# Altium schematic sheet MCU.SchDoc
size A4
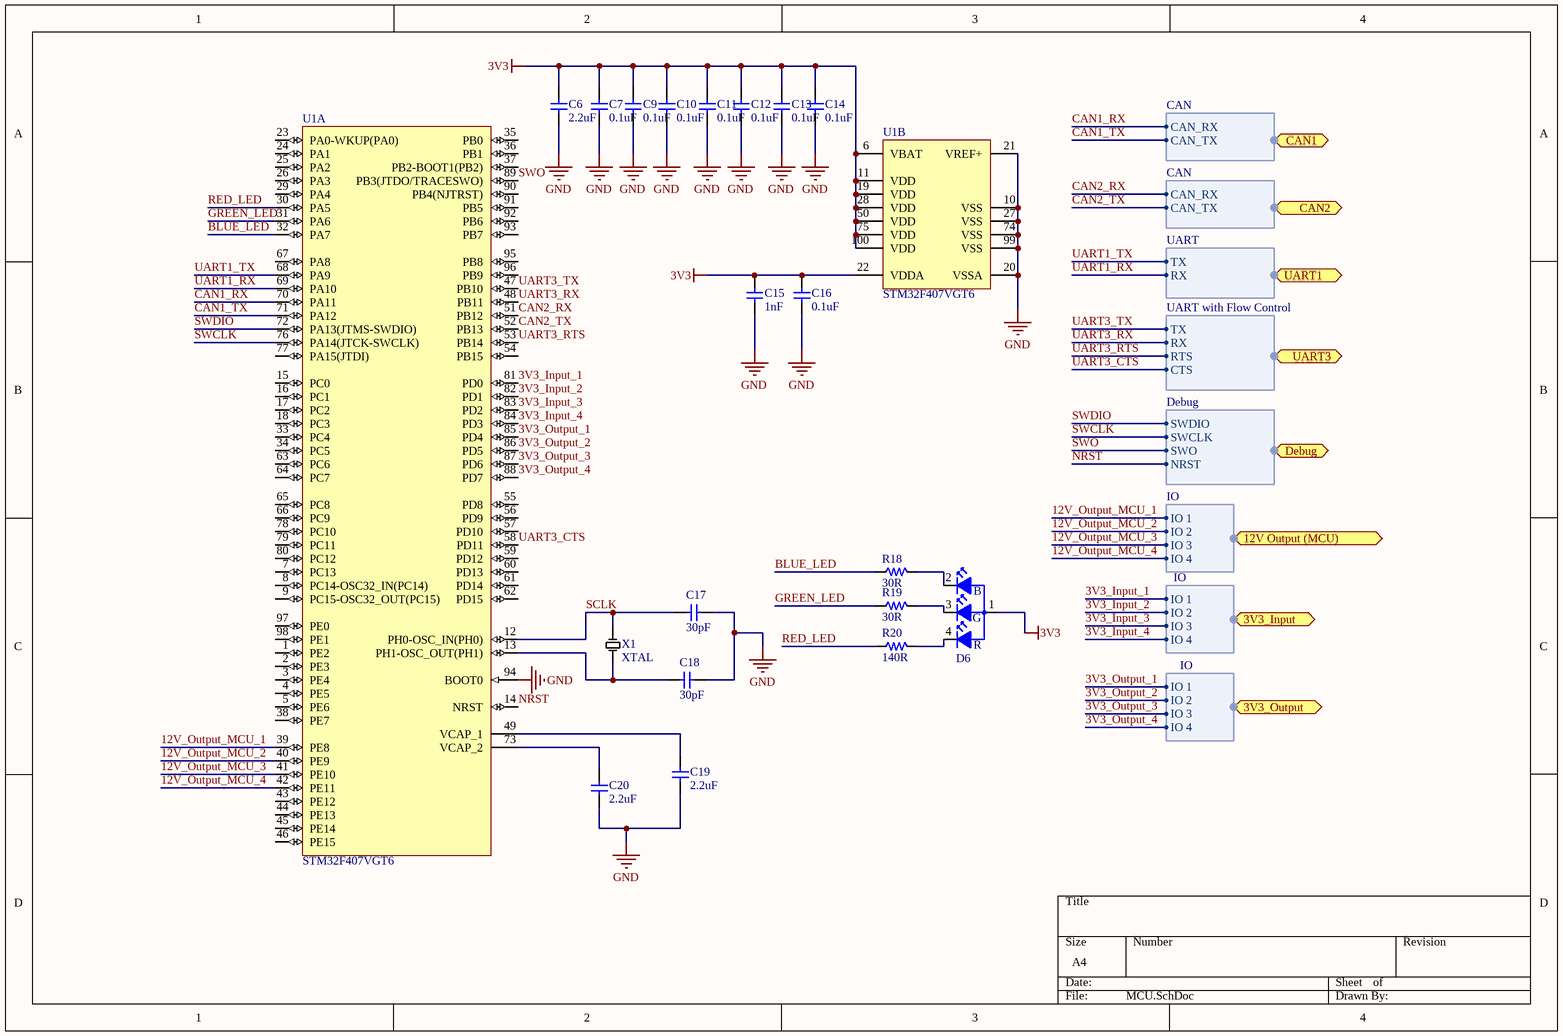
[diagram p0: MCU.SchDoc]

## Parts
C6  value 2.2uF  [PCB_GENERIC_SMD_0603]  (hidden comment: C060-002U2-00)
C7  value 0.1uF  [PCB_GENERIC_SMD_0603]  (hidden comment: C060-000U1-00)
C9  value 0.1uF  [PCB_GENERIC_SMD_0603]  (hidden comment: C060-000U1-00)
C10  value 0.1uF  [PCB_GENERIC_SMD_0603]  (hidden comment: C060-000U1-00)
C11  value 0.1uF  [PCB_GENERIC_SMD_0603]  (hidden comment: C060-000U1-00)
C12  value 0.1uF  [PCB_GENERIC_SMD_0603]  (hidden comment: C060-000U1-00)
C13  value 0.1uF  [PCB_GENERIC_SMD_0603]  (hidden comment: C060-000U1-00)
C14  value 0.1uF  [PCB_GENERIC_SMD_0603]  (hidden comment: C060-000U1-00)
C15  value 1nF  [PCB_GENERIC_SMD_0603]  (hidden comment: C060-0001N-00)
C16  value 0.1uF  [PCB_GENERIC_SMD_0603]  (hidden comment: C060-000U1-00)
C17  value 30pF  [PCB_GENERIC_SMD_0603]  (hidden comment: C060-0030P-00)
C18  value 30pF  [PCB_GENERIC_SMD_0603]  (hidden comment: C060-0030P-00)
C19  value 2.2uF  [PCB_GENERIC_SMD_0603]  (hidden comment: C060-002U2-00)
C20  value 2.2uF  [PCB_GENERIC_SMD_0603]  (hidden comment: C060-002U2-00)
D6  D0S4-000CR-00  [CLMVB-FKA]  (value not drawn)
R18  value 30R  [PCB_GENERIC_SMD_0603]  (hidden comment: R060-00300-05)
R19  value 30R  [PCB_GENERIC_SMD_0603]  (hidden comment: R060-00300-05)
R20  value 140R  [PCB_GENERIC_SMD_0603]  (hidden comment: R060-00141-05)
U1  STM32F407VGT6  [STM-LQFP100_M]  (parts A,B of 2)
X1  XTAL  [CRYSTAL_8MHZ]

## Ports
3V3_Input (harness IO), 3V3_Output (harness IO), 12V Output (MCU) (harness IO), CAN1 (harness CAN), CAN2 (harness CAN), Debug (harness Debug), UART1 (harness UART), UART3 (harness UART with Flow Control)

## Harnesses
CAN: CAN_RX, CAN_TX
Debug: SWDIO, SWCLK, SWO, NRST
UART with Flow Control: TX, RX, RTS, CTS
UART: TX, RX
IO: IO 1, IO 2, IO 3, IO 4

## Nets
3V3: C6.2 C7.2 C9.2 C10.2 C11.2 C12.2 C13.2 C14.2 C15.2 C16.2 D6.1(Red) U1.6(VBAT) U1.11(VDD) U1.19(VDD) U1.22(VDDA) U1.28(VDD) U1.50(VDD) U1.75(VDD) U1.100(VDD)
GND: C6.1 C7.1 C9.1 C10.1 C11.1 C12.1 C13.1 C14.1 C15.1 C16.1 C17.1 C18.1 C19.1 C20.1 U1.10(VSS) U1.20(VSSA) U1.21(VREF+) U1.27(VSS) U1.74(VSS) U1.94(BOOT0) U1.99(VSS)
3V3_Input_1: U1.81(PD0) ; port 3V3_Input.IO 1
3V3_Input_2: U1.82(PD1) ; port 3V3_Input.IO 2
3V3_Input_3: U1.83(PD2) ; port 3V3_Input.IO 3
3V3_Input_4: U1.84(PD3) ; port 3V3_Input.IO 4
3V3_Output_1: U1.85(PD4) ; port 3V3_Output.IO 1
3V3_Output_2: U1.86(PD5) ; port 3V3_Output.IO 2
3V3_Output_3: U1.87(PD6) ; port 3V3_Output.IO 3
3V3_Output_4: U1.88(PD7) ; port 3V3_Output.IO 4
12V_Output_MCU_1: U1.39(PE8) ; port 12V Output (MCU).IO 1
12V_Output_MCU_2: U1.40(PE9) ; port 12V Output (MCU).IO 2
12V_Output_MCU_3: U1.41(PE10) ; port 12V Output (MCU).IO 3
12V_Output_MCU_4: U1.42(PE11) ; port 12V Output (MCU).IO 4
BLUE_LED: R18.1 U1.32(PA7)
CAN1_RX: U1.70(PA11) ; port CAN1.CAN_RX
CAN1_TX: U1.71(PA12) ; port CAN1.CAN_TX
CAN2_RX: U1.51(PB12) ; port CAN2.CAN_RX
CAN2_TX: U1.52(PB13) ; port CAN2.CAN_TX
GREEN_LED: R19.1 U1.31(PA6)
NRST: U1.14(NRST) ; port Debug.NRST
RED_LED: R20.1 U1.30(PA5)
SCLK: C17.2 U1.12(PH0-OSC_IN(PH0)) X1.1
SWCLK: U1.76(PA14(JTCK-SWCLK)) ; port Debug.SWCLK
SWDIO: U1.72(PA13(JTMS-SWDIO)) ; port Debug.SWDIO
SWO: U1.89(PB3(JTDO/TRACESWO)) ; port Debug.SWO
UART1_RX: U1.69(PA10) ; port UART1.RX
UART1_TX: U1.68(PA9) ; port UART1.TX
UART3_CTS: U1.58(PD11) ; port UART3.CTS
UART3_RTS: U1.53(PB14) ; port UART3.RTS
UART3_RX: U1.48(PB11) ; port UART3.RX
UART3_TX: U1.47(PB10) ; port UART3.TX
NetC18_2: C18.2 U1.13(PH1-OSC_OUT(PH1)) X1.2
NetC19_2: C19.2 U1.49(VCAP_1)
NetC20_2: C20.2 U1.73(VCAP_2)
NetD6_2: D6.2(Green) R18.2
NetD6_3: D6.3(Blue) R19.2
NetD6_4: D6.4 R20.2

Not connected (* = marked no-connect by the designer): U1 1(PE2) 2(PE3) 3(PE4) 4(PE5) 5(PE6) 7(PC13) 8(PC14-OSC32_IN(PC14)) 9(PC15-OSC32_OUT(PC15)) 15(PC0) 16(PC1) 17(PC2) 18(PC3) 23(PA0-WKUP(PA0)) 24(PA1) 25(PA2) 26(PA3) 29(PA4) 33(PC4) 34(PC5) 35(PB0) 36(PB1) 37(PB2-BOOT1(PB2)) 38(PE7) 43(PE12) 44(PE13) 45(PE14) 46(PE15) 54(PB15) 55(PD8) 56(PD9) 57(PD10) 59(PD12) 60(PD13) 61(PD14) 62(PD15) 63(PC6) 64(PC7) 65(PC8) 66(PC9) 67(PA8) 77(PA15(JTDI)) 78(PC10) 79(PC11) 80(PC12) 90(PB4(NJTRST)) 91(PB5) 92(PB6) 93(PB7) 95(PB8) 96(PB9) 97(PE0) 98(PE1)

## Notes on the sheet
- (in symbol D0S4-000CR-00) B; G; R

## Library data of the parts
C6 C19 C20 = C060-002U2-00: CAP CER 0603 2.2uF 16V X5R 20%; Tolerance: 20%; Voltage: 16V; Package: 0603
C7 C9-C14 C16 = C060-000U1-00: CAP CER 0603 0.1uF 16V X5R 20%; Tolerance: 20%; Voltage: 16V; Package: 0603
C15 = C060-0001N-00: CAP CER 0603 1nF 50V X7R 10%; Tolerance: 10%; Voltage: 50V; Package: 0603
C17 C18 = C060-0030P-00: CAP CER 0603 30pF 50V NP0 5%; Tolerance: 5%; Voltage: 50V; Package: 0603
D6 = D0S4-000CR-00: LED 4SMD RGB 2Vf 3Vf 3Vf 20mA 10mA 10mA; Supplier 1: Digi-Key; Supplier Part Number 1: CLMVB-FKA-CFHEHLCBB7A363CT-ND; Color: RGB
R18 R19 = R060-00300-05: RES 0603 30ohm 5% 100mW; Tolerance: 5%; Power: 100mW; Package: 0603
R20 = R060-00141-05: RES 0603 140ohm 5% 63mW; Tolerance: 5%; Power: 63mW; Package: 0603
U1 = STM32F407VGT6: ARM Cortex-M4 32-bit MCU+FPU, 210 DMIPS, 1024 kB Flash, 192 kB Internal RAM, 82 I/Os, 100-pin LQFP, -40 to 85 degC, Tray; Manufacturer: STMicroelectronics; D/A Converter: 2x12-bit; FLASH Size (Prog) (kB): 1024; I/Os (High Current): 82; Internal RAM Size (kB): 192; Operating Frequency(F) (Processor speed) (MHz): 168; Supply Voltage(Vcc) max (V): 3.6; Supply Voltage(Vcc) min (V): 1.8; DatasheetVersion: Rev. 4; PackageVersion: Rev. 1, 06/2013; PackageReference: LQFP100; PackageDescription: 100-Pin Low Profile Quad Flat Package, 14 x 14 mm Body, 0.5 mm Pitch; Supplier 1: Digi-Key; Supplier Part Number 1: 497-11605-ND; Supplier 2: Farnell; Supplier Part Number 2: 2064368; Supplier 3: Newark; Supplier Part Number 3: 73T2333; Supplier 4: Mouser; Supplier Part Number 4: 511-STM32F407VGT6; Core: ARM Cortex-M4; Packing: Tray; Mounting Technology: Surface Mount; PartNumber: STM32F407VGT6; ComponentLink1Description: Manufacturer URL; ComponentLink1URL: http://www.st.com/web/en/home.html; ComponentLink2Description: Datasheet; ComponentLink2URL: http://www.st.com/st-web-ui/static/active/en/resource/technical/document/datasheet/DM00037051.pdf; ComponentLink3Description: Package Specification; ComponentLink3URL: http://www.st.com/st-web-ui/static/active/en/resource/technical/document/data_brief/DM00071938.pdf
X1 = Crystal: Frequency: 8MHz